# Altium project Interface-bottom.PrjPcb
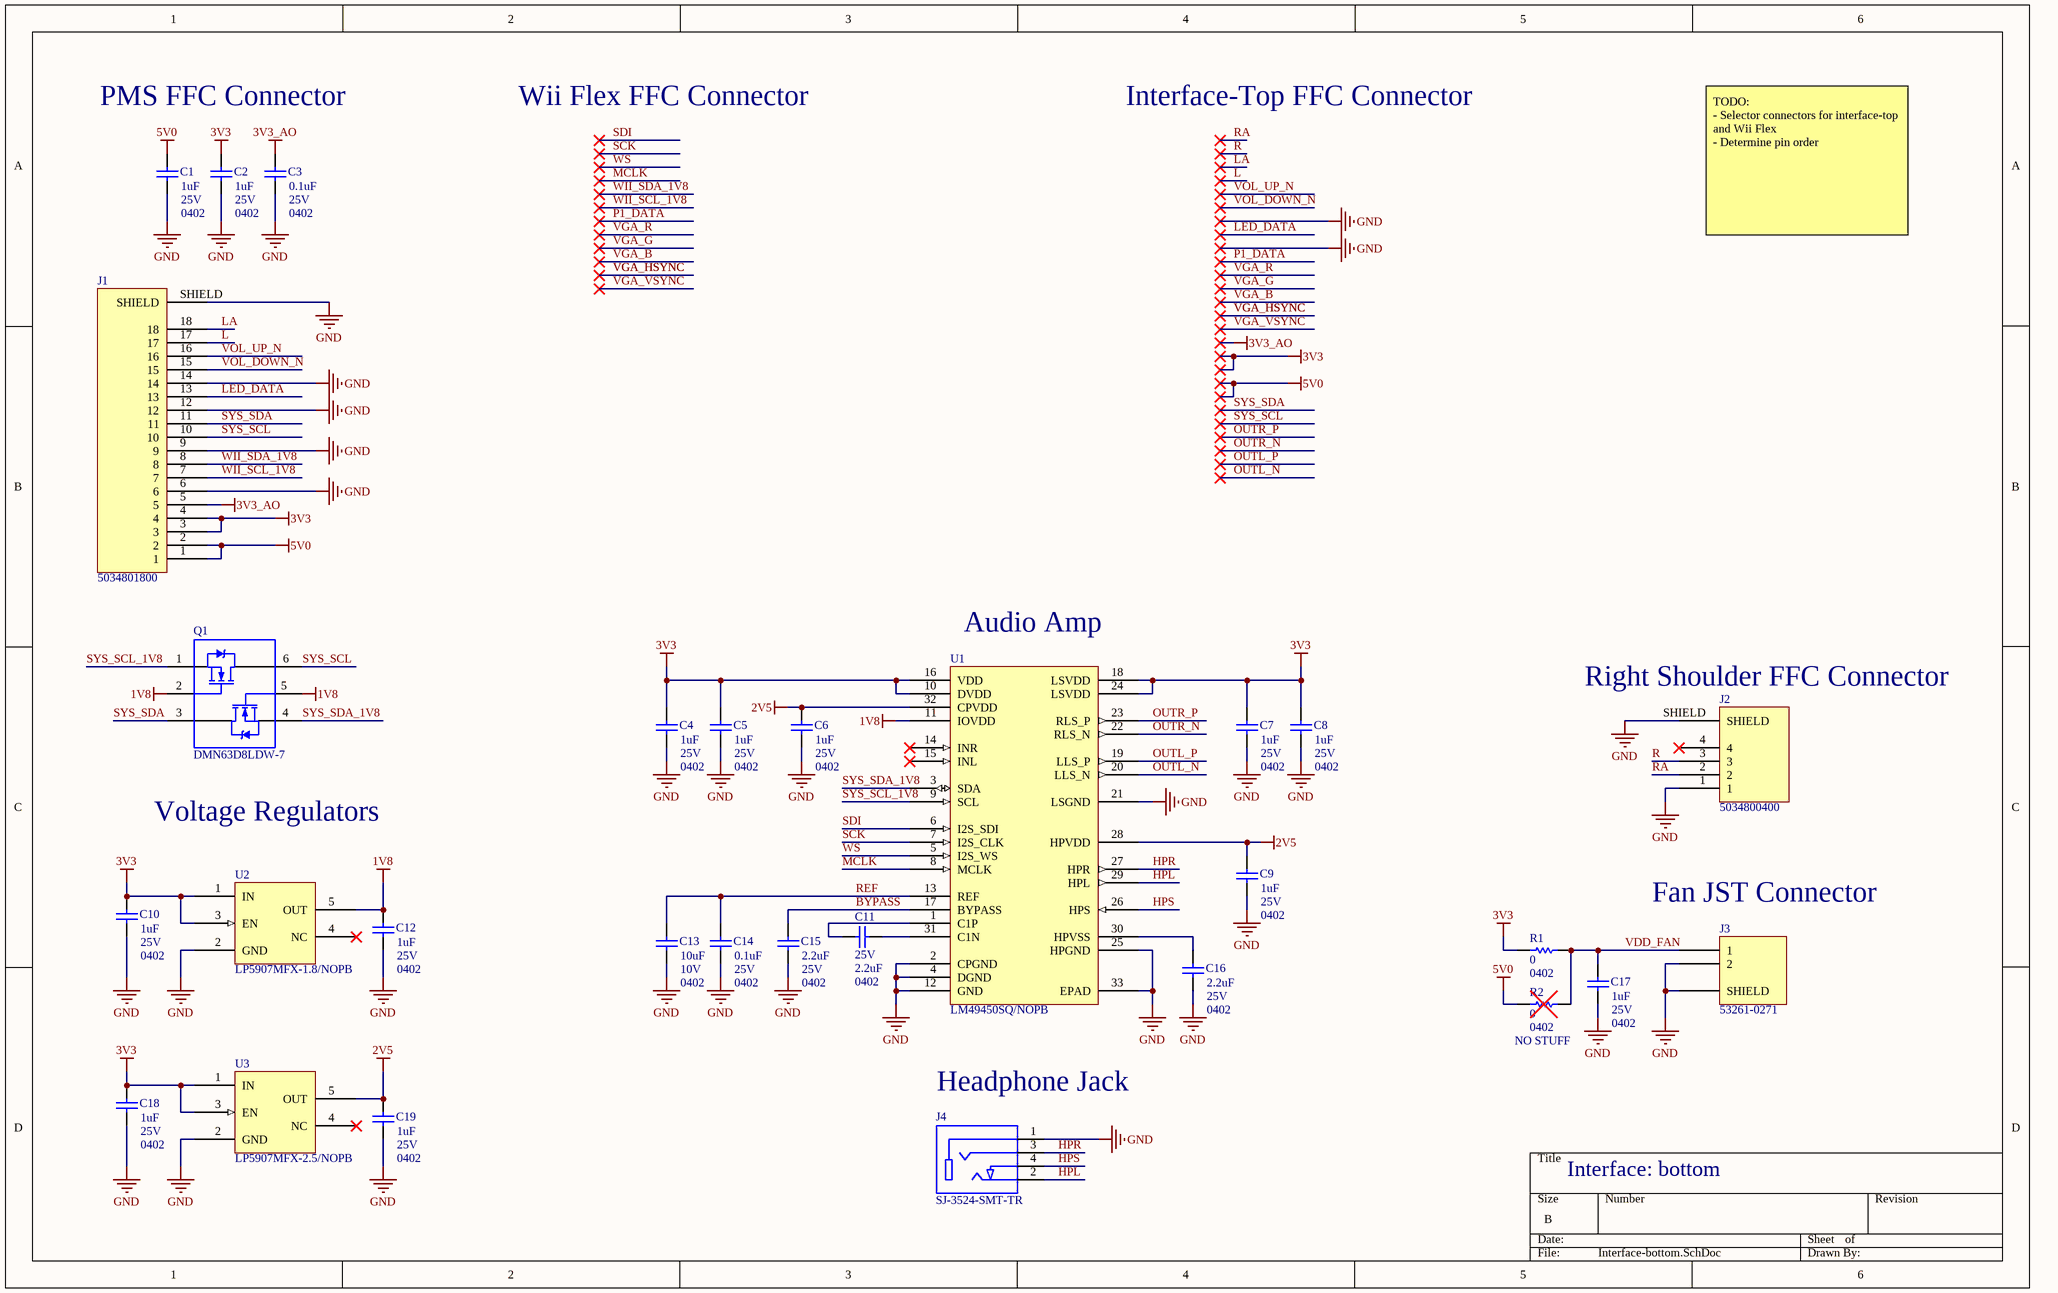
[diagram p0: Interface-bottom.SchDoc]
1 sheet, 29 parts. Net scope: global (net labels, ports and power ports of the same name join across sheets).
Board file: Interface-bottom.PcbDoc

## Sheet Interface-bottom.SchDoc
size B

### Parts
C1  value 1uF  Rated Voltage: 25V  Package: 0402  [CAPC1005X06N]  (hidden comment: Capacitor)
C2  value 1uF  Rated Voltage: 25V  Package: 0402  [CAPC1005X06N]  (hidden comment: Capacitor)
C3  value 0.1uF  Rated Voltage: 25V  Package: 0402  [CAPC1005X06N]  (hidden comment: Capacitor)
C4  value 1uF  Rated Voltage: 25V  Package: 0402  [CAPC1005X06N]  (hidden comment: Capacitor)
C5  value 1uF  Rated Voltage: 25V  Package: 0402  [CAPC1005X06N]  (hidden comment: Capacitor)
C6  value 1uF  Rated Voltage: 25V  Package: 0402  [CAPC1005X06N]  (hidden comment: Capacitor)
C7  value 1uF  Rated Voltage: 25V  Package: 0402  [CAPC1005X06N]  (hidden comment: Capacitor)
C8  value 1uF  Rated Voltage: 25V  Package: 0402  [CAPC1005X06N]  (hidden comment: Capacitor)
C9  value 1uF  Rated Voltage: 25V  Package: 0402  [CAPC1005X06N]  (hidden comment: Capacitor)
C10  value 1uF  Rated Voltage: 25V  Package: 0402  [CAPC1005X06N]  (hidden comment: Capacitor)
C11  value 2.2uF  Rated Voltage: 25V  Package: 0402  [CAPC1005X06N]  (hidden comment: Capacitor)
C12  value 1uF  Rated Voltage: 25V  Package: 0402  [CAPC1005X06N]  (hidden comment: Capacitor)
C13  value 10uF  Rated Voltage: 10V  Package: 0402  [CAPC1005X06N]  (hidden comment: Capacitor)
C14  value 0.1uF  Rated Voltage: 25V  Package: 0402  [CAPC1005X06N]  (hidden comment: Capacitor)
C15  value 2.2uF  Rated Voltage: 25V  Package: 0402  [CAPC1005X06N]  (hidden comment: Capacitor)
C16  value 2.2uF  Rated Voltage: 25V  Package: 0402  [CAPC1005X06N]  (hidden comment: Capacitor)
C17  value 1uF  Rated Voltage: 25V  Package: 0402  [CAPC1005X06N]  (hidden comment: Capacitor)
C18  value 1uF  Rated Voltage: 25V  Package: 0402  [CAPC1005X06N]  (hidden comment: Capacitor)
C19  value 1uF  Rated Voltage: 25V  Package: 0402  [CAPC1005X06N]  (hidden comment: Capacitor)
J1  5034801800  [5034801800]
J2  5034800400  [5034800400]
J3  53261-0271  [0532610271]
J4  SJ-3524-SMT-TR  [SJ-3524-SMT-TR]
Q1  DMN63D8LDW-7  [SOT65P210X110-6N]
R1  value 0  Package: 0402  [RESC1005X04N]  (hidden comment: Resistor)
R2  value 0  Package: 0402  Note: NO STUFF  [RESC1005X04N]  (hidden comment: Resistor)
U1  LM49450SQ/NOPB  [QFN50P500X500X80_HS-33N]
U2  LP5907MFX-1.8/NOPB  [SOT95P280X145-5N]
U3  LP5907MFX-2.5/NOPB  [SOT95P280X145-5N]

### Nets
1V8: C12.2 Q1.2(G1) Q1.5(G2) U1.11(IOVDD) U2.5(OUT)
2V5: C6.2 C9.2 C19.2 U1.28(HPVDD) U1.32(CPVDD) U3.5(OUT)
3V3: C2.2 C4.2 C5.2 C7.2 C8.2 C10.2 C18.2 J1.3 J1.4 R1.1 U1.10(DVDD) U1.16(VDD) U1.18(LSVDD) U1.24(LSVDD) U2.1(IN) U2.3(EN) U3.1(IN) U3.3(EN)
3V3_AO: C3.2 J1.5
5V0: C1.2 J1.1 J1.2 R2.1
GND: C1.1 C2.1 C3.1 C4.1 C5.1 C6.1 C7.1 C8.1 C9.1 C10.1 C12.1 C13.1 C14.1 C15.1 C16.1 C17.1 C18.1 C19.1 J1.6 J1.9 J1.12 J1.14 J1.SHIELD J2.1 J2.SHIELD J3.2 J3.SHIELD J4.1 U1.2(CPGND) U1.4(DGND) U1.12(GND) U1.21(LSGND) U1.25(HPGND) U1.33(EPAD) U2.2(GND) U3.2(GND)
BYPASS: C15.2 U1.17(BYPASS)
HPL: J4.2 U1.29(HPL)
HPR: J4.3 U1.27(HPR)
HPS: J4.4 U1.26(HPS)
L: J1.17
LA: J1.18
LED_DATA: J1.13
MCLK: U1.8(MCLK)
OUTL_N: U1.20(LLS_N)
OUTL_P: U1.19(LLS_P)
OUTR_N: U1.22(RLS_N)
OUTR_P: U1.23(RLS_P)
R: J2.3
RA: J2.2
REF: C13.2 C14.2 U1.13(REF)
SCK: U1.7(I2S_CLK)
SDI: U1.6(I2S_SDI)
SYS_SCL: J1.10 Q1.6(D1)
SYS_SCL_1V8: Q1.1(S1) U1.9(SCL)
SYS_SDA: J1.11 Q1.3(D2)
SYS_SDA_1V8: Q1.4(S2) U1.3(SDA)
VDD_FAN: C17.2 J3.1 R1.2 R2.2
VOL_DOWN_N: J1.15
VOL_UP_N: J1.16
WII_SCL_1V8: J1.7
WII_SDA_1V8: J1.8
WS: U1.5(I2S_WS)
NetC11_1: C11.1 U1.31(C1N)
NetC11_2: C11.2 U1.1(C1P)
NetC16_2: C16.2 U1.30(HPVSS)

Not connected (* = marked no-connect by the designer): J2 4*; U1 14(INR)* 15(INL)*; U2 4(NC)*; U3 4(NC)*

### Notes on the sheet
- PMS FFC Connector
- Wii Flex FFC Connector
- Interface-Top FFC Connector
- TODO:
  - Selector connectors for interface-top and Wii Flex
  - Determine pin order
- (near U1) Audio Amp
- (near J2) Right Shoulder FFC Connector
- Voltage Regulators
- (near J3) Fan JST Connector
- (near J4) Headphone Jack
- Interface: bottom

### Library data of the parts
C1-C19 = Capacitor: General purpose capacitor
J1 = 5034801800: CONN FFC FPC 18POS 0.50MM R/A; Manufacturer: Molex; Actuator Material: Nylon,Glass,Polyamide; Number of Positions: 18; Max Voltage Rating (AC): 50V; Current Rating: 500mA; Mating Cycles: 10; Stackable: No; Contact Location: Dual; Gender: Receptacle; Wire/Cable Type: Straight; Pitch: 0.5mm; Supplier 1: Digi-Key; Manufacturer Part Number: 5034801800; RoHS: Yes; Category: FFC / FPC; Stock 1: 15433; Pricing 1: 1=1.44000, 10=1.31000, 25=1.23000, 50=1.17660, 100=1.12310, 250=1.01616, 500=0.93594, 1000=0.80223 (USD); Housing Material: Polymer; Contact Material: Bronze,Gold; Housing Color: White; Contact Plating: Gold,Tin; Material: Bronze; Min Operating Temperature: -40°C; Max Operating Temperature: 85°C; Packaging: Tape and Reel; Termination: SMD/SMT; Number of Contacts: 18; Orientation: Right Angle; Number of Rows: 1; Package Quantity: 3000; Voltage Rating: 50V; Number of Circuits: 18; Voltage Rating (AC): 50V; Length: 10.7mm; Depth: 4mm; Radiation Hardening: No; Flammability Rating: UL94 V-0; REACH SVHC: Unknown; Halogen Free: Low Halogen; ELV: Compliant; ComponentLink1URL: https://datasheet.ciiva.com/671/5034800400-sd-671136.pdf?src-supplier=Digi-Key; ComponentLink1Description: https://datasheet.ciiva.com/671/5034800400-sd-671136.pdf?src-supplier=Digi-Key; ComponentLink2URL: https://datasheet.ciiva.com/5137/5034801800-ffc-fpc-connectors-179548-5137672.pdf?src-supplier=Mouser; ComponentLink2Description: https://datasheet.ciiva.com/5137/5034801800-ffc-fpc-connectors-179548-5137672.pdf?src-supplier=Mouser; ComponentLink3URL: https://datasheet.ciiva.com/10366/5034801800-ffc-fpc-connectors-10366583.pdf?src-supplier=Avnet; ComponentLink3Description: https://datasheet.ciiva.com/10366/5034801800-ffc-fpc-connectors-10366583.pdf?src-supplier=Avnet
J2 = 5034800400: CONN FFC FPC 4POS 0.50MM R/A; Manufacturer: Molex; Actuator Material: Nylon,Glass,Polyamide; Current Rating: 500mA; Voltage Rating: 50V; Wire/Cable Type: Straight; Number of Positions: 4; Mating Cycles: 10; Stackable: No; Gender: Female; Pitch: 0.5mm; Supplier 1: Digi-Key; Manufacturer Part Number: 5034800400; RoHS: Yes; Category: FFC / FPC; Stock 1: 13432; Pricing 1: 1=0.70000, 10=0.65200, 25=0.58640, 50=0.52140, 100=0.49970, 250=0.45624, 500=0.43450, 1000=0.35846 (USD); Contact Material: Bronze; Contact Plating: Gold; Housing Color: White; Housing Material: Polymer; Material: Bronze; Min Operating Temperature: -40°C; Max Operating Temperature: 85°C; Number of Rows: 1; Orientation: Right Angle; Termination: Solder; Package Quantity: 1; Packaging: Tape and Reel; Max Voltage Rating (AC): 50V; Number of Contacts: 4; Max Voltage Rating (DC): 50V; Number of Circuits: 4; Voltage Rating (AC): 50V; Length: 3.7mm; Depth: 4mm; Radiation Hardening: No; Flammability Rating: UL94 V-0; REACH SVHC: No SVHC; Halogen Free: Low Halogen; ELV: Compliant; ComponentLink1URL: https://datasheet.ciiva.com/671/5034800400-sd-671136.pdf?src-supplier=Digi-Key; ComponentLink1Description: https://datasheet.ciiva.com/671/5034800400-sd-671136.pdf?src-supplier=Digi-Key; ComponentLink2URL: https://datasheet.ciiva.com/15249/392825034800400-ffc-fpc-nectors-15249120.pdf?src-supplier=Arrow+Europe; ComponentLink2Description: https://datasheet.ciiva.com/15249/392825034800400-ffc-fpc-nectors-15249120.pdf?src-supplier=Arrow+Europe; ComponentLink3URL: https://datasheet.ciiva.com/16658/5034800400-ffc-fpc-connectors-16658883.pdf?src-supplier=Avnet+Europe; ComponentLink3Description: https://datasheet.ciiva.com/16658/5034800400-ffc-fpc-connectors-16658883.pdf?src-supplier=Avnet+Europe; ComponentLink4URL: https://datasheet.ciiva.com/3926/135095034800400-ffc-fpc-nectors-3926214.pdf?src-supplier=Arrow; ComponentLink4Description: https://datasheet.ciiva.com/3926/135095034800400-ffc-fpc-nectors-3926214.pdf?src-supplier=Arrow; ComponentLink5URL: https://datasheet.ciiva.com/5137/5034800400-ffc-fpc-connectors-179546-5137607.pdf?src-supplier=Mouser; ComponentLink5Description: https://datasheet.ciiva.com/5137/5034800400-ffc-fpc-connectors-179546-5137607.pdf?src-supplier=Mouser; ComponentLink6URL: https://datasheet.ciiva.com/671/5034800400-sd-671137.pdf?src-supplier=Digi-Key; ComponentLink6Description: https://datasheet.ciiva.com/671/5034800400-sd-671137.pdf?src-supplier=Digi-Key; ComponentLink7URL: https://datasheet.ciiva.com/671/5034800400-sd-671138.pdf?src-supplier=Digi-Key; ComponentLink7Description: https://datasheet.ciiva.com/671/5034800400-sd-671138.pdf?src-supplier=Digi-Key; ComponentLink8URL: https://datasheet.ciiva.com/10366/5034800400-ffc-fpc-connectors-10366566.pdf?src-supplier=Avnet; ComponentLink8Description: https://datasheet.ciiva.com/10366/5034800400-ffc-fpc-connectors-10366566.pdf?src-supplier=Avnet
J3 = 53261-0271: MOLEX - 53261-0271 - CONNECTOR, HEADER, 2POS, 1ROW, 1.25MM; Number of Positions: 2; Gender: Male; Contact Resistance: 20mR; Voltage Rating: 125V; Current Rating: 1A; Insulation Resistance: 100MR; Glow Wire Compliant: Non-compliant; Supplier 1: Digi-Key; Manufacturer: Molex; Manufacturer Part Number: 53261-0271; RoHS: Yes; Category: Headers and Wire Housings; Stock 1: 27056; Pricing 1: 1=0.51000, 10=0.48200, 100=0.36940, 500=0.32120 (USD); Mount: Surface Mount; Contact Material: Bronze,Tin; Contact Plating: Tin; Color: Beige; Housing Material: Thermoplastic; Min Operating Temperature: -40°C; Max Operating Temperature: 85°C; Number of Rows: 1; Packaging: Tape and Reel; Termination: SMD/SMT; Voltage Rating (AC): 125V; Package Quantity: 1000; Number of Contacts: 2; Working Voltage: 125V; Orientation: Right Angle; Number of Circuits: 2; Voltage Rating (DC): 125V; Lead Pitch: 1.25mm; Pitch: 1.25mm; Radiation Hardening: No; Flammability Rating: UL94 V-0; REACH SVHC: Unknown; Lead Free: Lead Free; ComponentLink1URL: https://datasheet.ciiva.com/11747/0900766b8078fc90-11747475.pdf?src-supplier=RSComponents; ComponentLink1Description: https://datasheet.ciiva.com/11747/0900766b8078fc90-11747475.pdf?src-supplier=RSComponents; ComponentLink2URL: https://datasheet.ciiva.com/7167/1626147-7167496.pdf?src-supplier=Newark; ComponentLink2Description: https://datasheet.ciiva.com/7167/1626147-7167496.pdf?src-supplier=Newark; ComponentLink3URL: https://datasheet.ciiva.com/30193/198270532610271-pcb-headers-30193321.pdf?src-supplier=Onlinecomponents.com; ComponentLink3Description: https://datasheet.ciiva.com/30193/198270532610271-pcb-headers-30193321.pdf?src-supplier=Onlinecomponents.com; ComponentLink4URL: https://datasheet.ciiva.com/5151/0532610271-pcb-headers-171053-5151611.pdf?src-supplier=Mouser; ComponentLink4Description: https://datasheet.ciiva.com/5151/0532610271-pcb-headers-171053-5151611.pdf?src-supplier=Mouser; ComponentLink5URL: https://datasheet.ciiva.com/34303/1932547-34303342.pdf?src-supplier=Jameco; ComponentLink5Description: https://datasheet.ciiva.com/34303/1932547-34303342.pdf?src-supplier=Jameco; ComponentLink6URL: https://datasheet.ciiva.com/16658/0532610271-pcb-headers-16658423.pdf?src-supplier=Avnet+Europe; ComponentLink6Description: https://datasheet.ciiva.com/16658/0532610271-pcb-headers-16658423.pdf?src-supplier=Avnet+Europe; ComponentLink7URL: https://datasheet.ciiva.com/17035/70091115-17035863.pdf?src-supplier=Allied+Electronics; ComponentLink7Description: https://datasheet.ciiva.com/17035/70091115-17035863.pdf?src-supplier=Allied+Electronics; ComponentLink8URL: https://datasheet.ciiva.com/7920/1887027-7920826.pdf?src-supplier=Element14; ComponentLink8Description: https://datasheet.ciiva.com/7920/1887027-7920826.pdf?src-supplier=Element14; ComponentLink9URL: https://datasheet.ciiva.com/9468/0532610271-pcb-headers-9468506.pdf?src-supplier=Avnet; ComponentLink9Description: https://datasheet.ciiva.com/9468/0532610271-pcb-headers-9468506.pdf?src-supplier=Avnet; ComponentLink10URL: https://datasheet.ciiva.com/22683/1626147-22683562.pdf?src-supplier=Element14; ComponentLink10Description: https://datasheet.ciiva.com/22683/1626147-22683562.pdf?src-supplier=Element14; ComponentLink11URL: https://datasheet.ciiva.com/46393/1808526-46393547.pdf?src-supplier=Element14; ComponentLink11Description: https://datasheet.ciiva.com/46393/1808526-46393547.pdf?src-supplier=Element14
J4 = SJ-3524-SMT-TR: Conn 3.5MM Audio Jack F 4 POS Solder RA SMD 3 Terminal 1 Port T/R; Manufacturer: CUI; Number of Conductors: 3; Number of Ports: 1; Gender: Female; Shielding: Unshielded; Current Rating: 1A; Supplier 1: Digi-Key; Manufacturer Part Number: SJ-3524-SMT-TR; RoHS: Yes; Category: Connectors; Stock 1: 138416; Pricing 1: 1=1.04000, 10=0.91700, 25=0.86320, 50=0.82740, 100=0.79130, 250=0.71940, 500=0.64746 (USD); Mount: Surface Mount; Case/Package: SMD/SMT; Color: Black; Contact Plating: Silver; Connector Type: Jack; Orientation: Horizontal; Termination: Solder; Packaging: Tape and Reel; Lead Free: Lead Free; ComponentLink1URL: https://datasheet.ciiva.com/7356/sj-352x-smt-series-7356584.pdf?src-supplier=Digi-Key; ComponentLink1Description: https://datasheet.ciiva.com/7356/sj-352x-smt-series-7356584.pdf?src-supplier=Digi-Key; ComponentLink2URL: https://datasheet.ciiva.com/16486/sj-352x-smt-series-16486874.pdf?src-supplier=Future+Electronics; ComponentLink2Description: https://datasheet.ciiva.com/16486/sj-352x-smt-series-16486874.pdf?src-supplier=Future+Electronics
Q1 = DMN63D8LDW-7: DIODES INC. - DMN63D8LDW-7 - Dual MOSFET, N Channel, 30 V, 260 mA, 2.8 ohm, SOT-363, Surface Mount; Rise Time: 3.2ns; Rds On Max: 2.8R; Input Capacitance: 22pF; Drain to Source Voltage (Vdss): 30V; Continuous Drain Current (ID): 260mA; Max Power Dissipation: 300mW; Turn-On Delay Time: 3.3ns; Turn-Off Delay Time: 12ns; Fall Time: 6.3ns; Number of Elements: 2; Power Dissipation: 400mW; Threshold Voltage: 1.5V; Gate to Source Voltage (Vgs): 20V; FET Type: 2 N-Channel; Supplier 1: Digi-Key; Manufacturer: Diodes; Manufacturer Part Number: DMN63D8LDW-7; RoHS: Yes; Category: MOSFETs; Stock 1: 67979; Pricing 1: 1=0.30000, 10=0.24300, 25=0.20360, 100=0.09950, 250=0.09796, 500=0.08302, 1000=0.05768 (USD); Mount: Surface Mount; Case/Package: SOT-363; Number of Pins: 6; Weight: 0.000212oz; Contact Plating: Tin,Matte; Min Operating Temperature: -55°C; Max Operating Temperature: 150°C; Package Quantity: 3000; Packaging: Tape and Reel; Drain to Source Resistance: 2.8R; Element Configuration: Dual; Number of Channels: 2; Drain to Source Breakdown Voltage: 30V; Length: 2.2mm; Height: 1mm; Width: 1.35mm; Radiation Hardening: No; REACH SVHC: No SVHC; Lead Free: Lead Free; ComponentLink1URL: https://datasheet.ciiva.com/30023/dmn63d8ldw-30023824.pdf?src-supplier=Avnet; ComponentLink1Description: https://datasheet.ciiva.com/30023/dmn63d8ldw-30023824.pdf?src-supplier=Avnet; ComponentLink2URL: https://datasheet.ciiva.com/6384/dmn63d8ldw-6384534.pdf?src-supplier=Digi-Key; ComponentLink2Description: https://datasheet.ciiva.com/6384/dmn63d8ldw-6384534.pdf?src-supplier=Digi-Key
R1 R2 = Resistor: General purpose resistor
U1 = LM49450SQ/NOPB: IC, AUDIO SUBSYSTEM D 32-LLP; Manufacturer: TI National Semiconductor; Power Supply Rejection Ratio (PSRR): 70dB; Number of Channels: 2; Max Output Power: 2.5W; Nominal Supply Current: 18mA; Voltage Gain: 53.8dB; Supply Type: Hex; Power Consumption: 57.6mW; Dual Supply Voltage: 5V; Max Supply Voltage: 5.5V; Min Supply Voltage: 1.8V; Number of Analog Outputs: 4; Load Impedance: 8R; Supplier 1: Digi-Key; Manufacturer Part Number: LM49450SQ/NOPB; RoHS: Yes; Category: Amplifiers - Audio; Stock 1: 899; Pricing 1: 1=5.36000, 10=4.81700, 25=4.55400, 100=3.74440, 250=3.35984, 500=3.23840 (USD); Mount: Surface Mount; Number of Pins: 32; Contact Plating: Tin; Min Operating Temperature: -40°C; Max Operating Temperature: 85°C; Packaging: Tape and Reel; Package Quantity: 1000; Output Power: 2.5W; Number of Analog Inputs: 2; Number of DAC Channels: 2; Features: I²C; Termination: SMD/SMT; Length: 5mm; Height: 0.8mm; Width: 5mm; Radiation Hardening: No; Lead Free: Lead Free; REACH SVHC: No SVHC; ComponentLink1URL: https://datasheet.ciiva.com/1482/90149-1482432.pdf?src-supplier=Element14; ComponentLink1Description: https://datasheet.ciiva.com/1482/90149-1482432.pdf?src-supplier=Element14; ComponentLink2URL: https://datasheet.ciiva.com/1489/1777553-1489572.pdf?src-supplier=Farnell; ComponentLink2Description: https://datasheet.ciiva.com/1489/1777553-1489572.pdf?src-supplier=Farnell; ComponentLink3URL: https://datasheet.ciiva.com/6631/lm49450-6631304.pdf?src-supplier=Digi-Key; ComponentLink3Description: https://datasheet.ciiva.com/6631/lm49450-6631304.pdf?src-supplier=Digi-Key; ComponentLink4URL: https://datasheet.ciiva.com/6631/lm49450-6631306.pdf?src-supplier=Digi-Key; ComponentLink4Description: https://datasheet.ciiva.com/6631/lm49450-6631306.pdf?src-supplier=Digi-Key; ComponentLink5URL: https://datasheet.ciiva.com/6631/lm49450-6631308.pdf?src-supplier=Digi-Key; ComponentLink5Description: https://datasheet.ciiva.com/6631/lm49450-6631308.pdf?src-supplier=Digi-Key
U2 = LP5907MFX-1.8/NOPB: IC REG LINEAR 1.8V 250MA SOT23-5; Manufacturer: Texas Instruments; Output Voltage Accuracy: 2%; Power Supply Rejection Ratio (PSRR): 82dB; Output Type: Fixed; Min Input Voltage: 2.2V; Number of Outputs: 1; Polarity: Positive; Quiescent Current: 25uA; Dropout Voltage: 250mV; Max Input Voltage: 5.5V; Supplier 1: Digi-Key; Manufacturer Part Number: LP5907MFX-1.8/NOPB; RoHS: Yes; Category: Voltage Regulators - Linear; Stock 1: 191037; Pricing 1: 1=0.54000, 10=0.46100, 25=0.43040, 100=0.31980, 250=0.27060, 500=0.25830, 1000=0.19065 (USD); Mount: Surface Mount; Case/Package: SOT-23; Number of Pins: 5; Contact Plating: Tin; Min Operating Temperature: -40°C; Max Operating Temperature: 125°C; Accuracy: 2%; Max Output Current: 250mA; Packaging: Tape and Reel; Package Quantity: 3000; Output Voltage: 1.8V; Number of Regulators: 1; Nominal Output Voltage: 1.8V; Output Current: 250mA; Lead Free: Lead Free; REACH SVHC: No SVHC; ComponentLink1URL: https://datasheet.ciiva.com/15083/lp5907-15083594.pdf?src-supplier=Digi-Key; ComponentLink1Description: https://datasheet.ciiva.com/15083/lp5907-15083594.pdf?src-supplier=Digi-Key
U3 = LP5907MFX-2.5/NOPB: IC REG LINEAR 2.5V 250MA SOT23-5; Manufacturer: Texas Instruments; Accuracy: 2%; Output Type: Fixed; Dropout Voltage: 50mV; Number of Outputs: 1; Min Input Voltage: 2.2V; Max Input Voltage: 5.5V; Polarity: Positive; Quiescent Current: 25uA; Supplier 1: Digi-Key; Manufacturer Part Number: LP5907MFX-2.5/NOPB; RoHS: Yes; Category: Voltage Regulators - Linear; Stock 1: 29463; Pricing 1: 1=0.54000, 10=0.46100, 25=0.43040, 100=0.31980, 250=0.27060, 500=0.25830, 1000=0.19065 (USD); Mount: Surface Mount; Case/Package: SOT-23; Number of Pins: 5; Min Operating Temperature: -40°C; Max Operating Temperature: 125°C; Max Output Current: 250mA; Output Current: 250mA; Output Voltage: 2.5V; Number of Regulators: 1; Packaging: Tape and Reel; Radiation Hardening: No; Lead Free: Lead Free; ComponentLink1URL: https://datasheet.ciiva.com/48505/lp5907-48505033.pdf?src-supplier=Avnet; ComponentLink1Description: https://datasheet.ciiva.com/48505/lp5907-48505033.pdf?src-supplier=Avnet